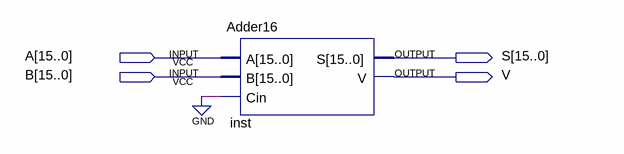
[diagram p0: schematic sheet]
// Quartus schematic Adder16a0.bdf as structural Verilog: 1 symbols, 4 pins
module Adder16a0 (
  input  [15:0] A,
  input  [15:0] B,
  output [15:0] S,
  output V
);

  Adder16 inst (.A(A), .B(B), .Cin(1'b0), .S(S), .V(V));
endmodule
